# EasyEDA schematic EasyEDA Schematic Source File.json
TITLE: Sheet_1; REV: 1.0; Date: 2026-06-23; Sheet: 1/1; Drawn By: 23121997doa; Company: Your Company
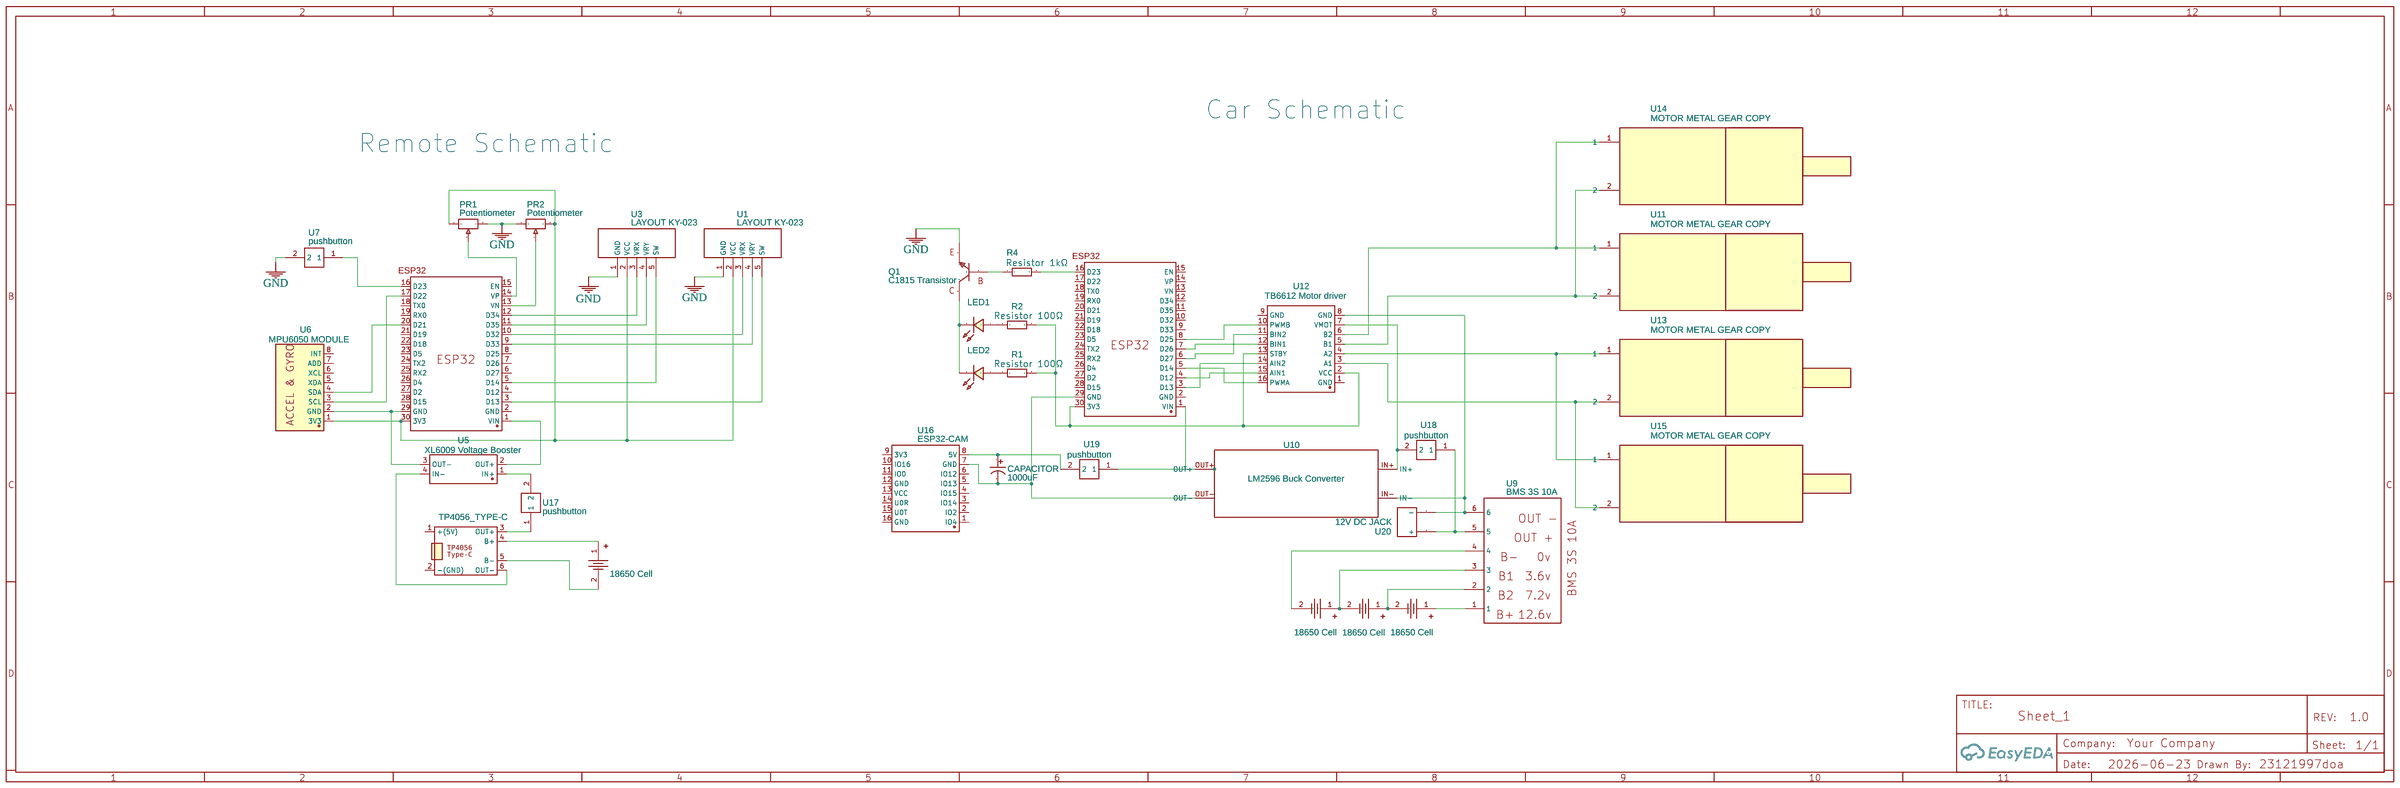
[diagram p0: schematic sheet]

## Parts
B1  18650 Cell  [THT-6-18MM-2.54MM-71.1MM-CELL18650-HOLDER]
B2  18650 Cell  [THT-6-18MM-2.54MM-71.1MM-CELL18650-HOLDER]
B3  18650 Cell  [THT-6-18MM-2.54MM-71.1MM-CELL18650-HOLDER]
B4  18650 Cell  [THT-6-18MM-2.54MM-71.1MM-CELL18650-HOLDER]
CAPACITOR  1000uF  [CAPACITOR 1000UF 25V]
LED1  LED-0603_R  [LED0603_RED]
LED2  LED-0603_R  [LED0603_RED]
PR1  Potentiometer  [WH160-1-104]
PR2  Potentiometer  [WH160-1-104]
Q1  C1815 Transistor  [Q_2SC1815]
R1  Resistor 100Ω  [RESISTOR_HOLE_SMD]
R2  Resistor 100Ω  [RESISTOR_HOLE_SMD]
R4  Resistor 1kΩ  [RESISTOR_HOLE_SMD]
U1  LAYOUT KY-023  [ARDUINO JOYSTICK KY-023]
U2  ESP_WROOM_32_30PIN  [ESP32-WROOM-32-30PIN]
U3  LAYOUT KY-023  [ARDUINO JOYSTICK KY-023]
U4  TP4056_TYPE-C  [TP4056_TYPE-C]
U5  XL6009 Voltage Booster  [XFMR-SMD_XL6009]
U6  MPU6050 MODULE  [MPU6050]
U7  pushbutton  [PUSHBUTTON]
U8  ESP_WROOM_32_30PIN  [ESP32-WROOM-32-30PIN]
U9  BMS 3S 10A  [BMS 3S 10A]
U10  LM2596 Buck Converter  [PCBLIB_LM2596-DC-DC-STEP-DOWN-BUCK-CONVERTER-POWER-MODULE-PACKAGE_2026-02-14]
U11  MOTOR METAL GEAR COPY  [MOTOR_METAL_GEAR]
U12  TB6612 Motor driver  [TB6612FGN_FP]
U13  MOTOR METAL GEAR COPY  [MOTOR_METAL_GEAR]
U14  MOTOR METAL GEAR COPY  [MOTOR_METAL_GEAR]
U15  MOTOR METAL GEAR COPY  [MOTOR_METAL_GEAR]
U16  ESP32-CAM  [COMM-TH_16P-L40.0-W27.0-P2.54_ESP32-CAM]
U17  pushbutton  [PUSHBUTTON]
U18  pushbutton  [PUSHBUTTON]
U19  pushbutton  [PUSHBUTTON]
U20  12V DC JACK  [12V JACK]

## Library data of the parts
B1-B4 = 18650 Cell: Contributor: Adam Ogiba
CAPACITOR = 1000uF 25V: Supplier: LCSC; Manufacturer: ValuePro; Supplier Part: C10750; LCSC Assembly: Yes; SMT Type: Extend; Contributor: Sarayuth
LED1 LED2 = LED-0603_R: Manufacturer: EVERLIGHT(台湾亿光); Manufacturer Part: 19-217/R6C-AL1M2VY/3T; Supplier Part: C72044; Supplier: LCSC; Contributor: LCEDA_01
PR1 PR2 = Potentiometer copy: Tolerance: ±25%; Supplier Part: C61836; Supplier: LCSC; Manufacturer: JML; Manufacturer Part: Potentiometer WH160-1-104
Q1 = Q_2SC1815: NPN General Purpose Amplifier; Supplier: Mouser; Contributor: Lainez It is the sound
R1 R2 R4 = Resistor_Hole_SMD: Supplier: LCSC; Supplier Part: MG; Manufacturer: ResistorToday; Manufacturer Part: MG; Contributor: Gowthamsai14
U1 U3 = LAYOUT KY-023: Contributor: petru.kim.sub
U2 U8 = ESP_WROOM_32_30PIN: Supplier: AliExpress; Supplier Part: -10pcs ESP32 WROOM-32 ESP32-S Development Board WiFi+Bluetooth-compatible TYPE-C ESP32 30Pin ESP32 Nodemcu Development Module; link: https://www.aliexpress.us/item/3256806290585259.html?spm=a2g0o.productlist.main.7.ccd7227eJbYZlN&algo_pvid=fc759b59-c127-43e1-8089-f4d4a7ed08f3&aem_p4p_detail=2024041611422016282122873043560000388607; Contributor: zafariqbal832159
U4 = TP4056_TYPE-C: Contributor: kavehs87
U5 = XL6009模块: Contributor: LCSC; Supplier: LCSC; Supplier Part: C2908146; Manufacturer: null; Manufacturer Part: xl6009模块; JLCPCB Part Class: Extended Part
U6 = MPU6050 MODULE: Supplier: Aliexpress; Contributor: jofenix
U7 U17-U19 = pushbutton: Contributor: super7800
U9 = BMS 3S 10A: Manufacturer: Generic; Contributor: cisss
U10 = LM2596: Contributor: isurukawshika
U11 U13-U15 = MOTOR METAL GEAR COPY: Contributor: Nihal Das
U12 = TB6612FNG: Contributor: e.birbragher
U16 = ESP32-CAM: Supplier: LCSC; Supplier Part: C277946; Manufacturer: Ai-Thinker(安信可); JLCPCB Part Class: Extended Part; Contributor: lcsc
U20 = 12V DC JACK: Contributor: mrbyby420

## Nets
GND: PR1.1 PR2.3 Q1.E U1.1(GND) U3.1(GND) U7.2
Net-(B1-1): B1.1 U4.4(B+)
Net-(B1-2): B1.2 U4.5(B-)
Net-(B2-1): B2.1 B3.2 U9.3
Net-(B2-2): B2.2 U9.4
Net-(B3-1): B3.1 B4.2 U9.2
Net-(B4-1): B4.1 U9.1
Net-(CAPACITOR-1): CAPACITOR.1 U16.8(5V) U19.2
Net-(CAPACITOR-2): CAPACITOR.2 U8.29(GND) U10.OUT- U16.7(GND)
Net-(LED1-1): LED1.1 R2.1
Net-(LED1-2): LED1.2 LED2.2 Q1.C
Net-(LED2-1): LED2.1 R1.1
Net-(PR1-2): PR1.2 U2.14(VP)
Net-(PR1-3): PR1.3 PR2.1 U1.2(VCC) U2.30(3V3) U3.2(VCC) U6.1(3V3)
Net-(PR2-2): PR2.2 U2.13(VN)
Net-(Q1-B): Q1.B R4.1
Net-(R1-2): R1.2 R2.2 U8.30(3V3) U12.2(VCC) U12.13(STBY)
Net-(R4-2): R4.2 U8.16(D23)
Net-(U1-3): U1.3(VRX) U2.10(D32)
Net-(U1-4): U1.4(VRY) U2.9(D33)
Net-(U1-5): U1.5(SW) U2.3(D13)
Net-(U2-1): U2.1(VIN) U5.2(OUT+)
Net-(U2-5): U2.5(D14) U3.5(SW)
Net-(U2-11): U2.11(D35) U3.4(VRY)
Net-(U2-12): U2.12(D34) U3.3(VRX)
Net-(U2-16): U2.16(D23) U7.1
Net-(U2-17): U2.17(D22) U6.3(SCL)
Net-(U2-20): U2.20(D21) U6.4(SDA)
Net-(U2-29): U2.29(GND) U5.3(OUT-) U6.2(GND)
Net-(U4-3): U4.3(OUT+) U17.1
Net-(U4-6): U4.6(OUT-) U5.4(IN-)
Net-(U5-1): U5.1(IN+) U17.2
Net-(U8-1): U8.1(VIN) U10.OUT+ U19.1
Net-(U8-3): U8.3(D13) U12.14(AIN2)
Net-(U8-4): U8.4(D12) U12.15(AIN1)
Net-(U8-5): U8.5(D14) U12.16(PWMA)
Net-(U8-6): U8.6(D27) U12.11(BIN2)
Net-(U8-7): U8.7(D26) U12.12(BIN1)
Net-(U8-8): U8.8(D25) U12.10(PWMB)
Net-(U9-5): U9.5 U18.1 U20.Vcc(+)
Net-(U9-6): U9.6 U10.IN- U12.8(GND) U20.GND(-)
Net-(U10-IN+): U10.IN+ U12.7(VMOT) U18.2
Net-(U11-1): U11.1 U12.6(B2) U14.1
Net-(U11-2): U11.2 U12.5(B1) U14.2
Net-(U12-3): U12.3(A1) U13.2 U15.2
Net-(U12-4): U12.4(A2) U13.1 U15.1

Not connected (* = marked no-connect by the designer): U2 2(GND) 4(D12) 6(D27) 7(D26) 8(D25) 15(EN) 18(TX0) 19(RX0) 21(D19) 22(D18) 23(D5) 24(TX2) 25(RX2) 26(D4) 27(D2) 28(D15); U4 1(+(5V)) 2(-(GND)); U6 5(XDA) 6(XCL) 7(ADD) 8(INT); U8 2(GND) 9(D33) 10(D32) 11(D35) 12(D34) 13(VN) 14(VP) 15(EN) 17(D22) 18(TX0) 19(RX0) 20(D21) 21(D19) 22(D18) 23(D5) 24(TX2) 25(RX2) 26(D4) 27(D2) 28(D15); U12 1(GND) 9(GND); U16 1(IO4) 2(IO2) 3(IO14) 4(IO15) 5(IO13) 6(IO12) 9(3V3) 10(IO16) 11(IO0) 12(GND) 13(VCC) 14(U0R) 15(U0T) 16(GND)

## Notes on the sheet
- Car Schematic
- Remote Schematic
